# EasyEDA schematic HVP board.json
TITLE: Sheet_1; REV: 1.0; Date: 2020-12-09; Sheet: 1/1; Drawn By: kennedyk1; Company: Your Company
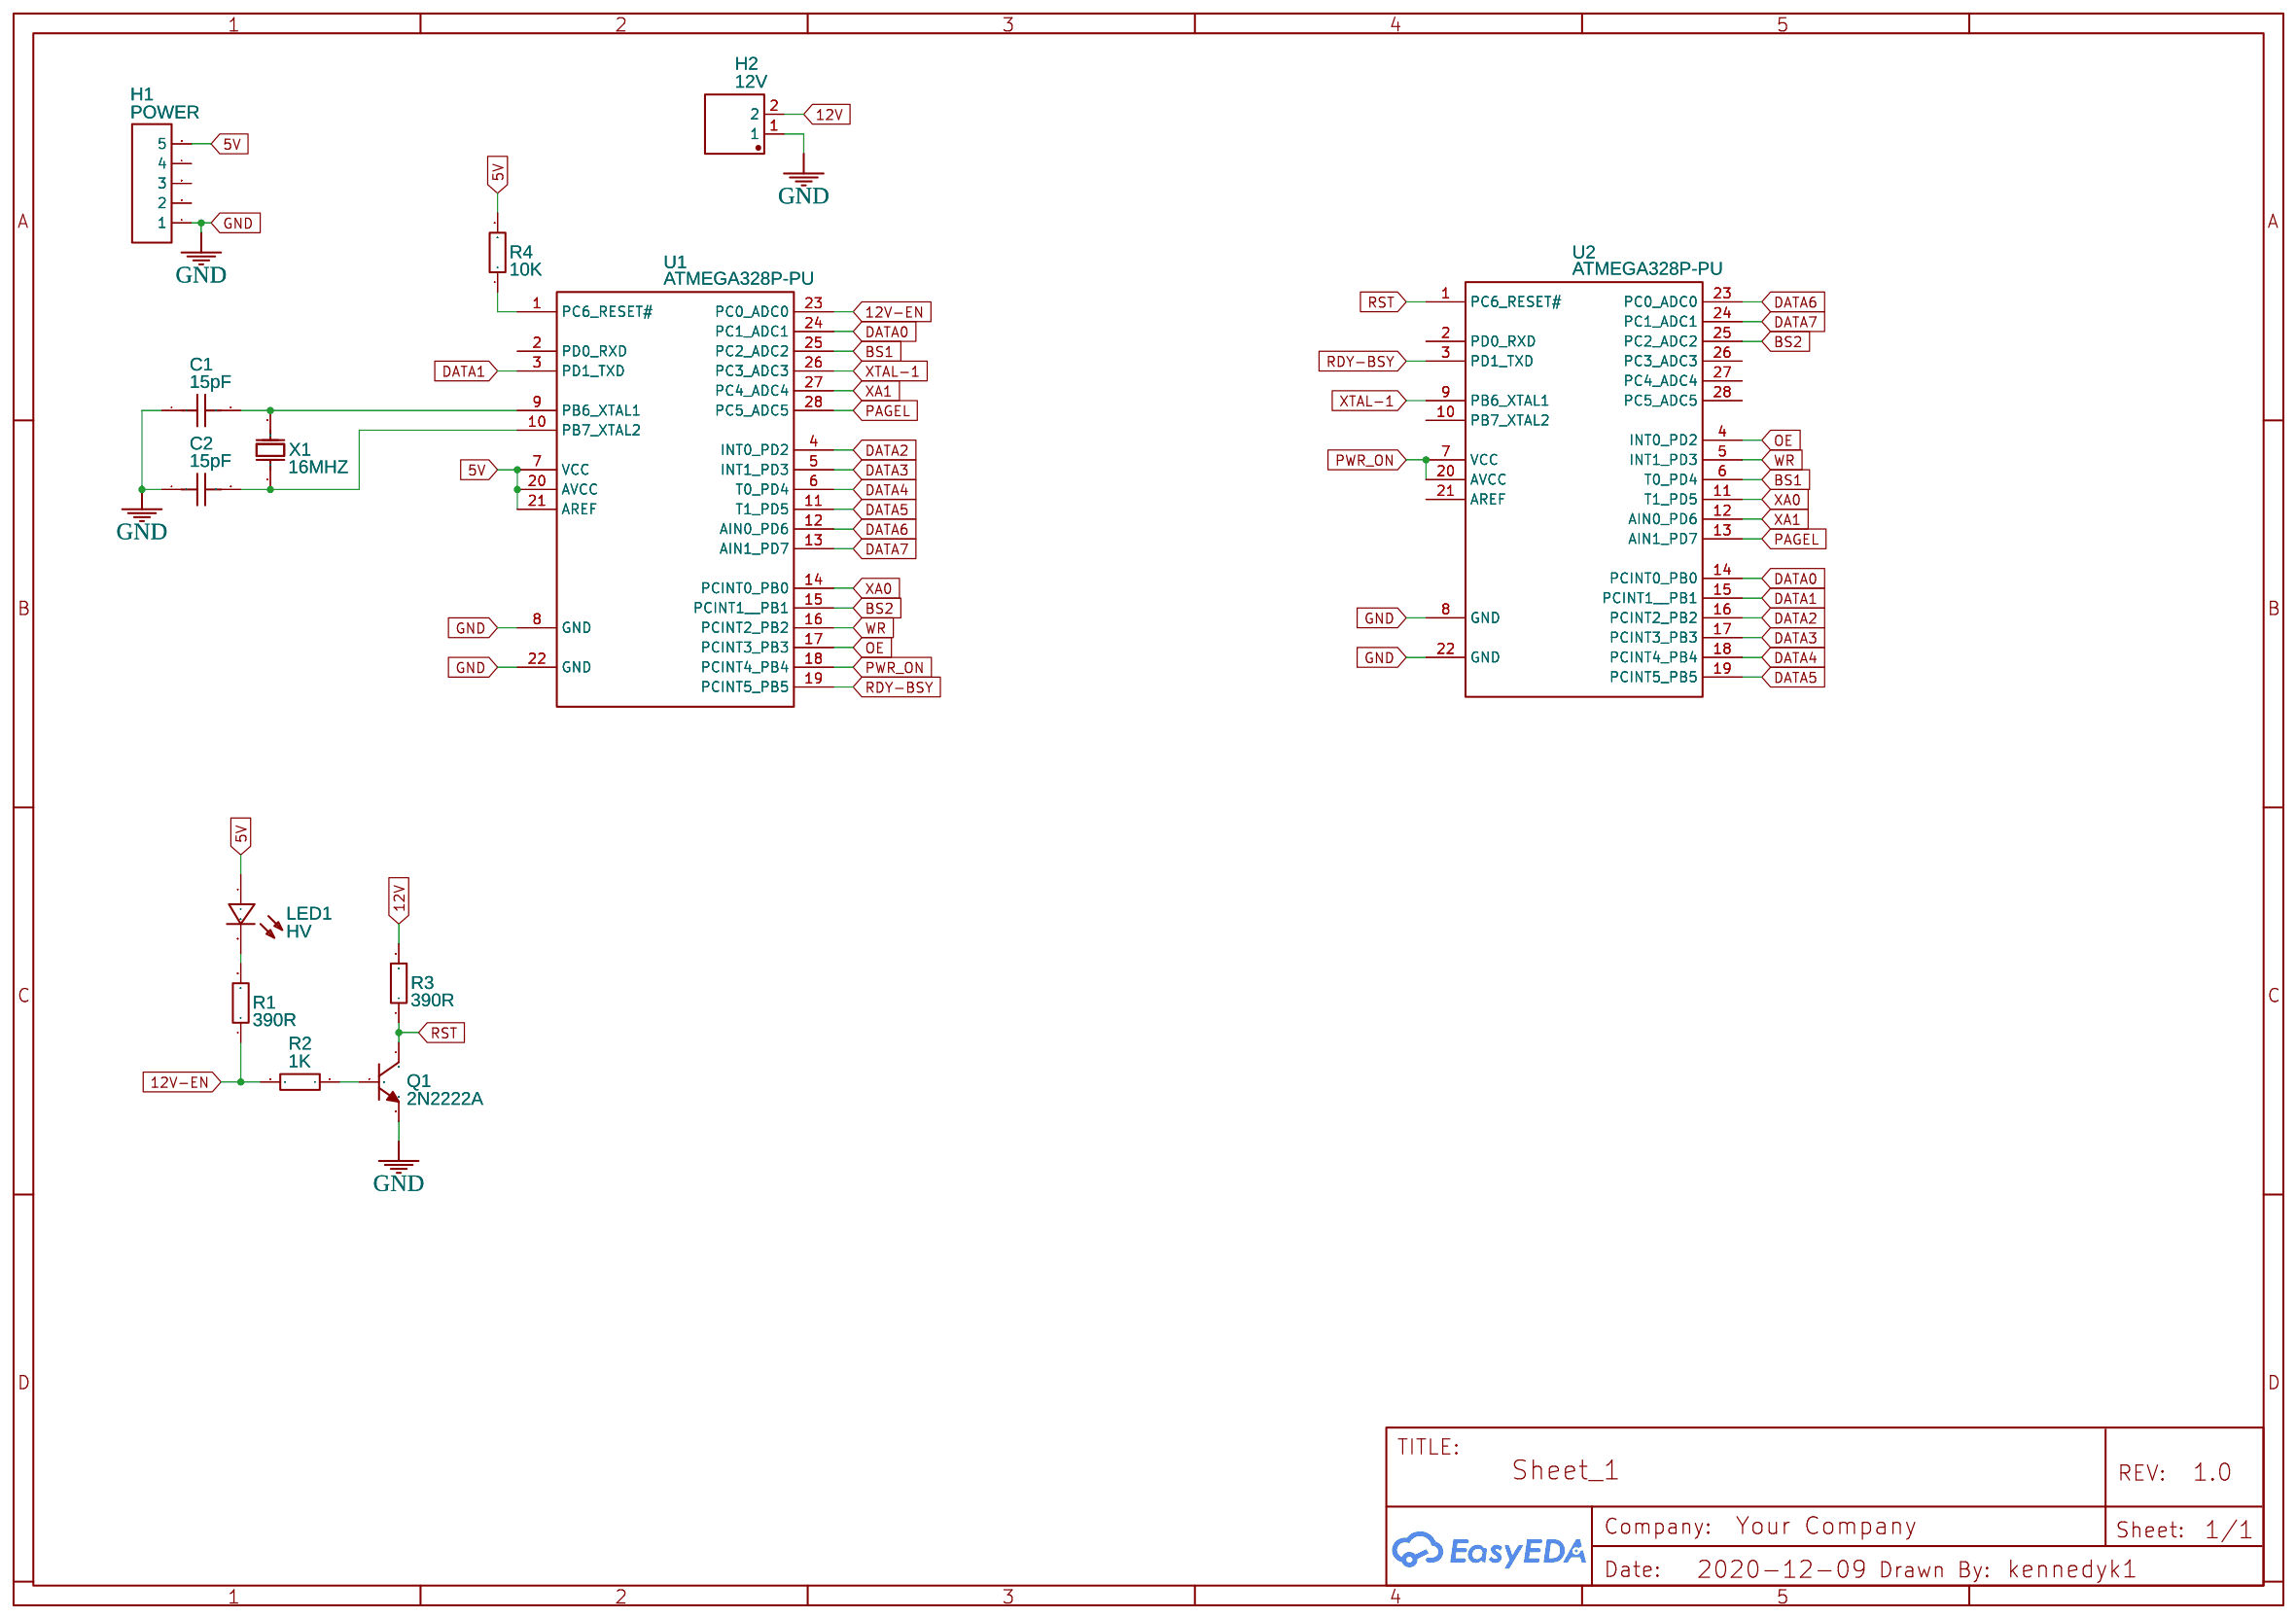
[diagram p0: schematic sheet]

## Parts
C1  15pF  [CAP-TH_L5.5-W2.0-P5.00-D1.0]
C2  15pF  [CAP-TH_L5.5-W2.0-P5.00-D1.0]
H1  POWER  [HDR-TH_5P-P2.54-V]
H2  12V  [HDR-TH_2P-P2.54-V]
LED1  HV  [LED-TH_BD5.9-P2.54-FD]
Q1  2N2222A  [TO-92-3_L4.8-W3.7-P2.54-R]
R1  390R  [RES-TH_BD2.2-L6.5-P10.50-D0.6]
R2  1K  [RES-TH_BD2.2-L6.5-P10.50-D0.6]
R3  390R  [RES-TH_BD2.2-L6.5-P10.50-D0.6]
R4  10K  [RES-TH_BD2.2-L6.5-P10.50-D0.6]
U1  ATMEGA328P-PU  [DIP-28_L34.6-W7.3-P2.54-LS10.2-BL]
U2  ATMEGA328P-PU  [DIP-28_L34.6-W7.3-P2.54-LS10.2-BL]
X1  16MHZ  [HC-49S_L11.0-W4.6-P4.88]

## Library data of the parts
C1 C2 = L06S1B150KN0B0S0N0: Supplier: LCSC; Supplier Part: C260719; Manufacturer: Songtian Elec; Contributor: LCSC
H1 = Header-Female-2.54_1x5: Supplier: LCSC; Manufacturer: BOOMELE; Manufacturer Part: 2.54mm 1*5p Female header; image: //image.lceda.cn/szlcsc/C50950.jpg; Supplier Part: C50950
H2 = 68000-102HLF: Supplier: LCSC; Supplier Part: C168673; Manufacturer: Amphenol ICC; Contributor: LCSC
LED1 = HLMP-1719: Supplier: LCSC; Supplier Part: C188721; Manufacturer: Broadcom; Contributor: LCSC
Q1 = 2N2222A: Supplier: LCSC; Supplier Part: C358533; Manufacturer: Foshan Blue Rocket Elec; Contributor: LCSC
R1-R4 = CFR0W4J0472A50: Supplier: LCSC; Manufacturer: UniOhm; Supplier Part: C61297
U1 U2 = ATMEGA328P-PU: sourceId: Oic6oiASL; Supplier: LCSC; Manufacturer: MICROCHIP; image: //image.lceda.cn/szlcsc/C33901.jpg; Contributor: LCSC; Supplier Part: C33901
X1 = 49SAC16000202060: Supplier: LCSC; Supplier Part: C390745; Manufacturer: JGHC; Contributor: LCSC

## Nets
5V: H1.5 LED1.1 R4.2 U1.7(VCC) U1.20(AVCC) U1.21(AREF)
12V: H2.2 R3.2
12V-EN: R1.1 R2.2 U1.23(PC0 ADC0)
GND: C1.1 C2.1 H1.1 H2.1 Q1.3(E) U1.8(GND) U1.22(GND) U2.8(GND) U2.22(GND)
BS1: U1.25(PC2 ADC2) U2.6(T0 PD4)
BS2: U1.15(PCINT1  PB1) U2.25(PC2 ADC2)
DATA0: U1.24(PC1 ADC1) U2.14(PCINT0 PB0)
DATA1: U1.3(PD1 TXD) U2.15(PCINT1  PB1)
DATA2: U1.4(INT0 PD2) U2.16(PCINT2 PB2)
DATA3: U1.5(INT1 PD3) U2.17(PCINT3 PB3)
DATA4: U1.6(T0 PD4) U2.18(PCINT4 PB4)
DATA5: U1.11(T1 PD5) U2.19(PCINT5 PB5)
DATA6: U1.12(AIN0 PD6) U2.23(PC0 ADC0)
DATA7: U1.13(AIN1 PD7) U2.24(PC1 ADC1)
OE: U1.17(PCINT3 PB3) U2.4(INT0 PD2)
PAGEL: U1.28(PC5 ADC5) U2.13(AIN1 PD7)
PWR_ON: U1.18(PCINT4 PB4) U2.7(VCC) U2.20(AVCC)
RDY-BSY: U1.19(PCINT5 PB5) U2.3(PD1 TXD)
RST: Q1.1(C) R3.1 U2.1(PC6 RESET#)
WR: U1.16(PCINT2 PB2) U2.5(INT1 PD3)
XA0: U1.14(PCINT0 PB0) U2.11(T1 PD5)
XA1: U1.27(PC4 ADC4) U2.12(AIN0 PD6)
XTAL-1: U1.26(PC3 ADC3) U2.9(PB6 XTAL1)
Net-(C1-2): C1.2 U1.9(PB6 XTAL1) X1.2(OSC2)
Net-(C2-2): C2.2 U1.10(PB7 XTAL2) X1.1(OSC1)
Net-(LED1-2): LED1.2 R1.2
Net-(Q1-2): Q1.2(B) R2.1
Net-(R4-1): R4.1 U1.1(PC6 RESET#)

Not connected (* = marked no-connect by the designer): H1 2 3 4; U1 2(PD0 RXD); U2 2(PD0 RXD) 10(PB7 XTAL2) 21(AREF) 26(PC3 ADC3) 27(PC4 ADC4) 28(PC5 ADC5)
